# EAGLE board ra-08h_development_board_V1.0-20230228 (EAGLE 9.5.1), part 1 of 2
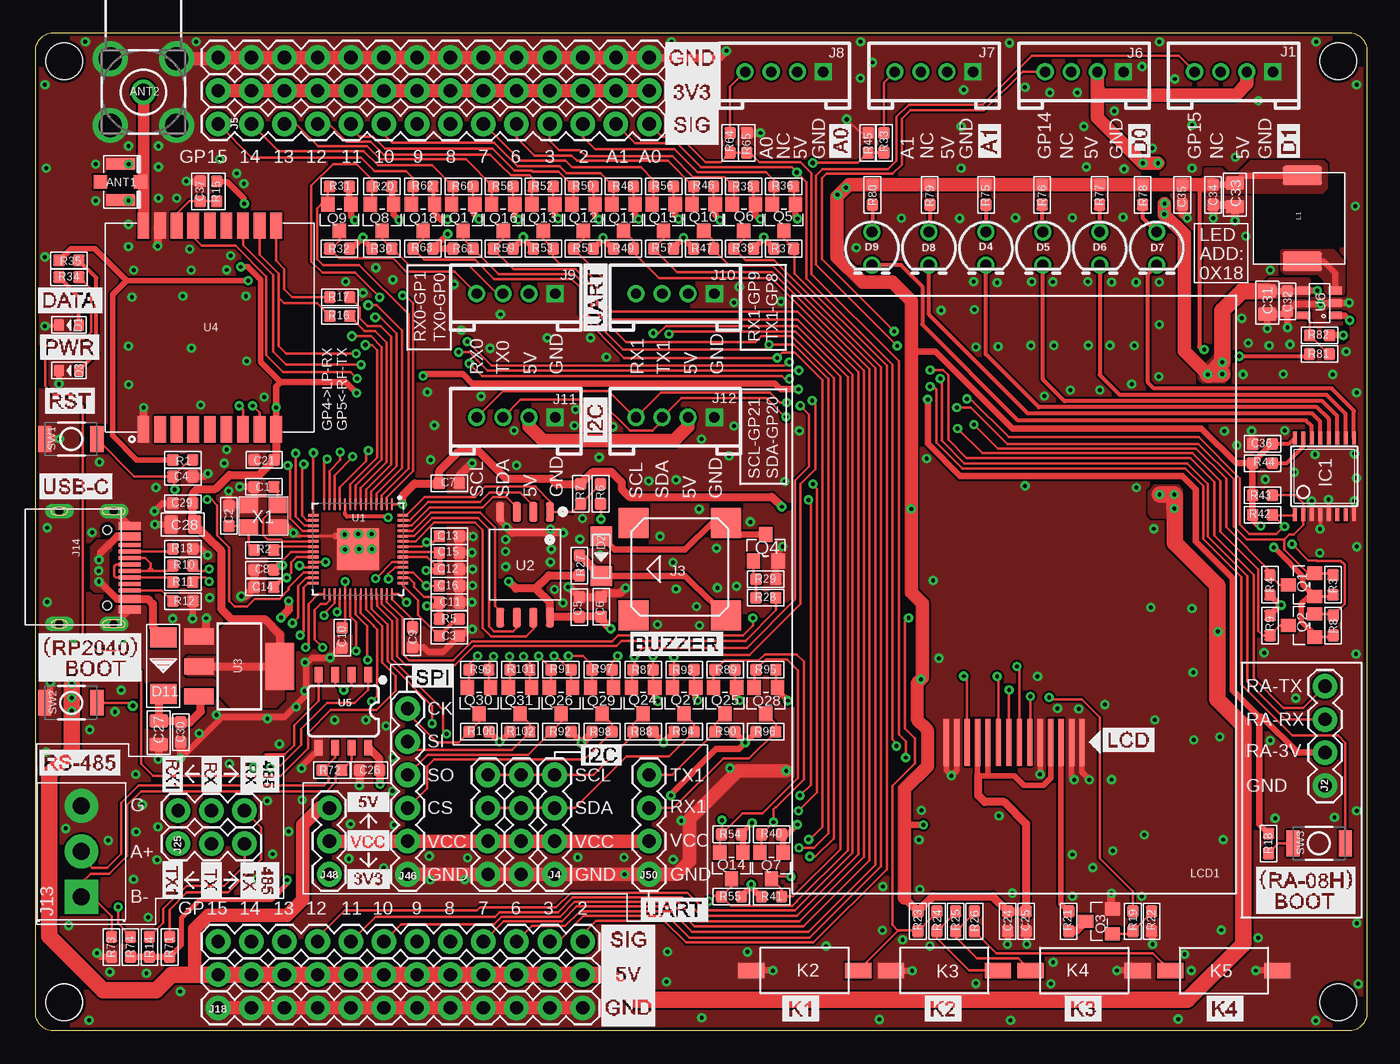
[diagram p7: board, top side]
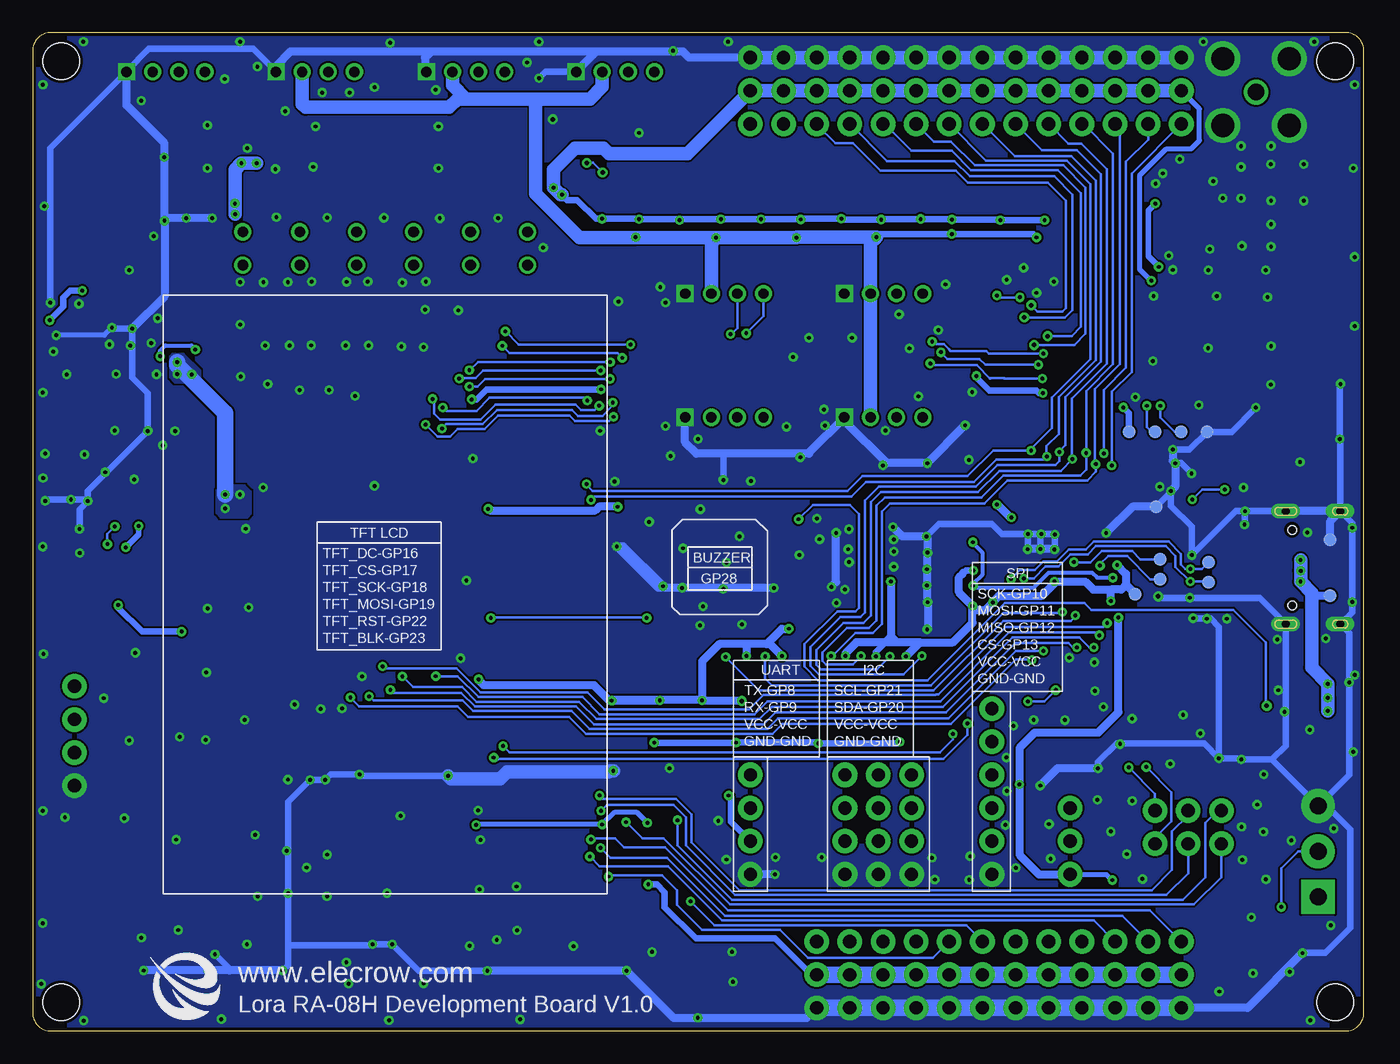
[diagram p8: board, bottom side, seen from below]

Size 102 x 76.5 mm. Coordinates in mm from the lower left corner, seen from the top.
Outline: 0,1.4 0,75.1 arc-90 1.4,76.5 100.6,76.5 arc-90 102,75.1 102,1.4 arc-90 100.6,0 1.4,0 arc-90 0,1.4
Copper layers (1*16): Top 0.035mm / dielectric 1.5mm / Bottom 0.035mm
Design rules "default *": minimum track width 0.2mm, minimum drill 0.3mm, track to track 6mil, track to pad 6mil, pad to pad 6mil, via to via 6mil, smd to smd 6mil, copper to edge 10mil, drill to drill 6mil, minimum pad ring 10mil, minimum via ring 8mil, stop-mask expansion 4mil, vias tented up to drill 100mil, thermal gap 10mil
Net classes: 0 default: width 0.203 mm; 1 PWR: width 0.254 mm; 2 GND: width 0.203 mm; 3 RS485: width 0.203 mm, clearance 0.203 mm; 4 USB: width 0.203 mm, clearance 0.152 mm; 5 ANT: width 0.889 mm, clearance 0.203 mm
Holes 2.8 mm at 2.2,74.3 99.8,74.3 2.2,2.2 99.8,2.2
tRestrict: area 98.6,52.7 to 100.6,54; 16 lines

## Footprints (pad centres in the part's own frame; a part is rotated, then mirrored left to right if it is on the bottom)
SPARKFUN2_U.FL = smd 2.2 x 0.85: P$1 0,1.375; P$2 0,-1.375 | smd 1.05 x 1: P$3 1.525,0; P$4 -1.525,0
BU-SMA-H = drill 1.27: 1 0,0 | drill 1.778: 2 -2.55,2.55; 3 2.55,2.55; 4 2.55,-2.55; 5 -2.55,-2.55
A_XBJ_0603 = smd 0.889 x 0.889: 1 -0.762,0; 2 0.762,0
A_XBJ_0805 = smd 1.016 x 1.397: 1 -0.889,0; 2 0.889,0
DISCRETE_D0603 = smd 0.762 x 0.889: + -0.762,0; - 0.762,0
DISCRETE_DO-35-SMD = smd 1.524 x 1.676: A -1.524,0; C 1.524,0
LED_3MM-NS = drill 0.813: A -1.27,0; K 1.27,0
DISCRETE_D2010 = smd 1.524 x 2.032: + -2.159,0; - 2.159,0
TSSOP16 = smd 0.305 x 0.991: 1 -2.275,-2.918; 2 -1.625,-2.918; 3 -0.975,-2.918; 4 -0.325,-2.918; 5 0.325,-2.918; 6 0.975,-2.918; 7 1.625,-2.918; 8 2.275,-2.918; 9 2.275,2.918; 10 1.625,2.918; 11 0.975,2.918; 12 0.325,2.918; 13 -0.325,2.918; 14 -0.975,2.918; 15 -1.625,2.918; 16 -2.275,2.918
CONNECTER_2.0_1X4 = drill 0.8 pad 1.27 square: 1 -3,0 | drill 0.8 pad 1.27: 2 -1,0; 3 1,0; 4 3,0
1X04 = drill 1.016 pad 1.88: 1 0,0; 2 2.54,0; 3 5.08,0; 4 7.62,0
A_XBJ_MLT-8530 = smd 2.3 x 2.3: 1 -3.55,3.55; 2 -3.55,-3.55; 3 3.55,-3.55; 4 3.55,3.55
1X14 = drill 1.016 pad 1.88: 1 0,0; 2 2.54,0; 3 5.08,0; 4 7.62,0; 5 10.16,0; 6 12.7,0; 7 15.24,0; 8 17.78,0; 9 20.32,0; 10 22.86,0; 11 25.4,0; 12 27.94,0; 13 30.48,0; 14 33.02,0
KF350_P3.5MM_3P = drill 1.3 pad 2.6 square: 1 -3.5,0 | drill 1.3 pad 2.6: 2 0,0; 3 3.5,0
KEVIN_3.0TYPEC-SMD = smd 0.3 x 1.7: A1 -3.35,0.5; A4 -2.55,0.5; A5 -1.25,0.5; A6 -0.25,0.5; A7 0.25,0.5; A8 1.25,0.5; A9 2.55,0.5; A12 3.35,0.5; B1 3.05,0.5; B4 2.25,0.5; B5 1.75,0.5; B6 0.75,0.5; B7 -0.75,0.5; B8 -1.75,0.5; B9 -2.25,0.5; B12 -3.05,0.5 | drill 0.6 pad 1.016 long: P$1 -4.325,-0.72; P$2 4.325,-0.72; P$3 -4.325,-4.9; P$4 4.325,-4.9 | hole 0.68: -2.89,-1.22; 2.89,-1.22
1X12 = drill 1.016 pad 1.88: 1 0,0; 2 2.54,0; 3 5.08,0; 4 7.62,0; 5 10.16,0; 6 12.7,0; 7 15.24,0; 8 17.78,0; 9 20.32,0; 10 22.86,0; 11 25.4,0; 12 27.94,0
1X03 = drill 1.016 pad 1.88: 1 0,0; 2 2.54,0; 3 5.08,0
1X06 = drill 1.016 pad 1.88: 1 0,0; 2 2.54,0; 3 5.08,0; 4 7.62,0; 5 10.16,0; 6 12.7,0
CROWBOT_-V1.2-20220713_CROWBOT-V1.1库_KEY_EN_2PIN_B/W = smd 2 x 1.2: 1 -4.1,0; 2 4.1,0
CROWPI_POW_L773 = smd 1.5 x 3: 1 -3.29,-0.254; 2 3.29,-0.254
TFF1.8_SPI_14P_PCB = smd 0.4 x 3.6: 1 5.2,0; 2 4.4,0; 3 3.6,0; 4 2.8,0; 5 2,0; 6 1.2,0; 7 0.4,0; 8 -0.4,0; 9 -1.2,0; 10 -2,0; 11 -2.8,0; 12 -3.6,0; 13 -4.4,0; 14 -5.2,0
CROWPI_POW_PAD-1.0MM = smd 1 x 1: P$1 0,0
DISCRETE_SOT23 = smd 1.016 x 1.143: 1 -0.889,-1.016; 2 0.889,-1.016; 3 0,1.016
DISCRETE_SOT23$1 = smd 1.016 x 1.143: 1 -0.95,-1.016; 2 0.95,-1.016; 3 0,1.016
DISCRETE_R0603 = smd 0.889 x 0.889: 1 -0.762,0; 2 0.762,0
MYSMD_157SW = smd 1.016 x 1.981: 1 0,0; 2 4,0
RP2040_QFN-56 = smd 0.875 x 0.2: 1 -3.437,2.6; 2 -3.437,2.2; 3 -3.437,1.8; 4 -3.437,1.4; 5 -3.437,1; 6 -3.437,0.6; 7 -3.437,0.2; 8 -3.437,-0.2; 9 -3.437,-0.6; 10 -3.437,-1; 11 -3.437,-1.4; 12 -3.437,-1.8; 13 -3.437,-2.2; 14 -3.437,-2.6; 29 3.437,-2.6; 30 3.437,-2.2; 31 3.437,-1.8; 32 3.437,-1.4; 33 3.437,-1; 34 3.437,-0.6; 35 3.437,-0.2; 36 3.437,0.2; 37 3.437,0.6; 38 3.437,1; 39 3.437,1.4; 40 3.437,1.8; 41 3.437,2.2; 42 3.437,2.6 | smd 0.2 x 0.875: 15 -2.6,-3.437; 16 -2.2,-3.437; 17 -1.8,-3.437; 18 -1.4,-3.437; 19 -1,-3.437; 20 -0.6,-3.437; 21 -0.2,-3.437; 22 0.2,-3.437; 23 0.6,-3.437; 24 1,-3.437; 25 1.4,-3.437; 26 1.8,-3.437; 27 2.2,-3.437; 28 2.6,-3.437; 43 2.6,3.437; 44 2.2,3.437; 45 1.8,3.437; 46 1.4,3.437; 47 1,3.437; 48 0.6,3.437; 49 0.2,3.437; 50 -0.2,3.437; 51 -0.6,3.437; 52 -1,3.437; 53 -1.4,3.437; 54 -1.8,3.437; 55 -2.2,3.437; 56 -2.6,3.437 | smd 3.2 x 3.2: EPAD 0,0
SELF_SOIC-8-208MIL = smd 1.5 x 0.635: 1 -4.05,1.905; 2 -4.05,0.635; 3 -4.05,-0.635; 4 -4.05,-1.905; 5 4.05,-1.905; 6 4.05,-0.635; 7 4.05,0.635; 8 4.05,1.905
SOT223 = smd 1.219 x 2.235: 1 -2.311,-3.099; 2 0,-3.099; 3 2.311,-3.099 | smd 3.6 x 2.2: 4 0,3.099
RA08H_MODULE_SMT_18P = smd 2 x 0.9: 1 -7.8,5.08; 2 -7.8,3.81; 3 -7.8,2.54; 4 -7.8,1.27; 5 -7.8,0; 6 -7.8,-1.27; 7 -7.8,-2.54; 8 -7.8,-3.81; 9 -7.8,-5.08; 10 7.8,-5.08; 11 7.8,-3.81; 12 7.8,-2.54; 13 7.8,-1.27; 14 7.8,0; 15 7.8,1.27; 16 7.8,2.54; 17 7.8,3.81; 18 7.8,5.08
SO08 = smd 0.6 x 1.2: 1 -1.905,-2.8; 2 -0.635,-2.8; 3 0.635,-2.8; 4 1.905,-2.8; 5 1.905,2.8; 6 0.635,2.8; 7 -0.635,2.8; 8 -1.905,2.8
CROWBOT_-V1.0-20220525_A_XBJ_SOT23-5 = smd 0.6 x 1: 1 -0.95,-1.2; 2 0,-1.2; 3 0.95,-1.2; 4 0.95,1.2; 5 -0.95,1.2
A_XBJ_SMD3225 = smd 1.4 x 1.2: 1 -1.1,-0.85; 2 1.1,-0.85; 3 1.1,0.85; 4 -1.1,0.85

## Placement (x,y rotation side)
ANT1  SPARKFUN2_U.FL  [SPARKFUN2_U.FL]  6.5,65.06 0 top
ANT2  BU-SMA-H  [BU-SMA-H]  8.26,71.94 90 top
C1  12PF  [A_XBJ_0603]  17.5,41.7 180 top
C2  12PF  [A_XBJ_0603]  14.8,39.46 270 top
C3  2.2UF  [A_XBJ_0603]  31.7,30.28 0 top
C4  100NF  [A_XBJ_0603]  11.28,42.48 0 top
C5  100NF  [A_XBJ_0603]  41.66,32.48 90 top
C6  2.2UF  [A_XBJ_0603]  43.34,32.51 90 top
C7  100NF  [A_XBJ_0603]  31.7,41.96 0 top
C8  100NF  [A_XBJ_0603]  17.5,35.35 180 top
C9  100NF  [A_XBJ_0603]  28.88,30.16 270 top
C10  100NF  [A_XBJ_0603]  23.49,30.14 270 top
C11  100NF  [A_XBJ_0603]  31.7,32.84 0 top
C12  100NF  [A_XBJ_0603]  31.7,35.37 0 top
C13  100NF  [A_XBJ_0603]  31.7,37.91 0 top
C14  100NF  [A_XBJ_0603]  17.5,34 180 top
C15  2.2UF  [A_XBJ_0603]  31.7,36.65 0 top
C16  2.2UF  [A_XBJ_0603]  31.7,34.11 0 top
C21  100NF  [A_XBJ_0603]  17.51,43.76 180 top
C24  100NF  [A_XBJ_0603]  74.48,8.4 270 top
C25  100NF  [A_XBJ_0603]  75.89,8.4 270 top
C26  100NF  [A_XBJ_0603]  25.59,19.98 0 top
C27  10UF  [A_XBJ_0805]  9.42,22.86 90 top
C28  10UF  [A_XBJ_0805]  11.28,38.81 0 top
C29  100NF  [A_XBJ_0603]  11.28,40.43 180 top
C30  100NF  [A_XBJ_0603]  11.12,22.88 270 top
C31  22UF  [A_XBJ_0805]  94.38,55.81 90 top
C32  1UF  [A_XBJ_0603]  95.91,55.92 270 top
C33  22UF  [A_XBJ_0805]  91.89,64.07 90 top
C34  1UF  [A_XBJ_0603]  90.22,64.08 270 top
C35  100NF  [A_XBJ_0603]  87.86,64.08 270 top
C36  100NF  [A_XBJ_0603]  94,45 180 top
C37  100NF  [A_XBJ_0603]  12.6,64.33 90 top
D1  [DISCRETE_D0603]  2.56,54.1 180 top
D2  1N4148  [DISCRETE_DO-35-SMD]  43.34,36.38 270 top
D3  [DISCRETE_D0603]  2.56,50.61 180 top
D4  [LED_3MM-NS]  72.81,59.95 270 top
D5  [LED_3MM-NS]  77.17,59.95 270 top
D6  [LED_3MM-NS]  81.54,59.95 270 top
D7  [LED_3MM-NS]  85.9,59.95 270 top
D8  [LED_3MM-NS]  68.44,59.95 270 top
D9  [LED_3MM-NS]  64.08,59.95 270 top
D11  SS14  [DISCRETE_D2010]  9.78,27.98 270 top
IC1  PCA9557-16P  [TSSOP16]  98.74,42.5 0 top
J1  CONNECTER_TWIG_2.0  [CONNECTER_2.0_1X4]  91.8,73.5 180 top
J2  [1X04]  98.79,18.79 90 top
J3  [A_XBJ_MLT-8530]  49.35,35.39 180 top
J4  [1X04]  39.76,12 90 top
J5  [1X14]  13.99,69.51 0 top
J6  CONNECTER_TWIG_2.0  [CONNECTER_2.0_1X4]  80.35,73.5 180 top
J7  CONNECTER_TWIG_2.0  [CONNECTER_2.0_1X4]  68.83,73.5 180 top
J8  CONNECTER_TWIG_2.0  [CONNECTER_2.0_1X4]  57.36,73.5 180 top
J9  CONNECTER_TWIG_2.0  [CONNECTER_2.0_1X4]  36.8,56.5 180 top
J10  CONNECTER_TWIG_2.0  [CONNECTER_2.0_1X4]  49,56.5 180 top
J11  CONNECTER_TWIG_2.0  [CONNECTER_2.0_1X4]  36.8,47.02 180 top
J12  CONNECTER_TWIG_2.0  [CONNECTER_2.0_1X4]  49,47.02 180 top
J13  KF350_P3.5MM_3P  [KF350_P3.5MM_3P]  3.51,13.76 90 top
J14  KEVIN_TYPEC-3.0-16P-SMD  [KEVIN_3.0TYPEC-SMD]  6.71,35.5 270 top
J18  [1X12]  13.99,1.77 0 top
J19  [1X12]  13.99,4.31 0 top
J20  [1X12]  13.99,6.85 0 top
J24  455-1750-1-ND  [1X03]  16,16.88 180 top
J25  455-1750-1-ND  [1X03]  16,14.34 180 top
J26  [1X14]  13.99,72.05 0 top
J27  [1X14]  13.99,74.59 0 top
J46  [1X06]  28.5,12 90 top
J47  [1X04]  37.2,12 90 top
J48  455-1750-1-ND  [1X03]  22.5,12 90 top
J49  [1X04]  34.66,12 90 top
J50  [1X04]  47,12 90 top
K2  CROWBO_KEY_2PIN_6.5X3.5  [CROWBOT_-V1.2-20220713_CROWBOT-V1.1库_KEY_EN_2PIN_B/W]  58.93,4.63 180 top
K3  CROWBO_KEY_2PIN_6.5X3.5  [CROWBOT_-V1.2-20220713_CROWBOT-V1.1库_KEY_EN_2PIN_B/W]  69.63,4.63 180 top
K4  CROWBO_KEY_2PIN_6.5X3.5  [CROWBOT_-V1.2-20220713_CROWBOT-V1.1库_KEY_EN_2PIN_B/W]  80.34,4.63 0 top
K5  CROWBO_KEY_2PIN_6.5X3.5  [CROWBOT_-V1.2-20220713_CROWBOT-V1.1库_KEY_EN_2PIN_B/W]  91.04,4.63 0 top
L1  2.2UH 2A  [CROWPI_POW_L773]  96.79,62.26 90 top
LCD1  TFT1.8_SPI_14P_PCB  [TFF1.8_SPI_14P_PCB]  74.97,22.12 0 top
P1  CROWPI_POW_PADPAD-1.0MM  [CROWPI_POW_PAD-1.0MM]  2.61,37.65 0 bottom
P2  CROWPI_POW_PADPAD-1.0MM  [CROWPI_POW_PAD-1.0MM]  2.61,33.35 0 bottom
P3  CROWPI_POW_PADPAD-1.0MM  [CROWPI_POW_PAD-1.0MM]  11.9,34.39 0 bottom
P4  CROWPI_POW_PADPAD-1.0MM  [CROWPI_POW_PAD-1.0MM]  11.9,35.9 0 bottom
P7  CROWPI_POW_PADPAD-1.0MM  [CROWPI_POW_PAD-1.0MM]  18,45.91 270 bottom
P8  CROWPI_POW_PADPAD-1.0MM  [CROWPI_POW_PAD-1.0MM]  16,45.91 270 bottom
P9  CROWPI_POW_PADPAD-1.0MM  [CROWPI_POW_PAD-1.0MM]  14,45.91 270 bottom
P10  CROWPI_POW_PADPAD-1.0MM  [CROWPI_POW_PAD-1.0MM]  12,45.91 270 bottom
P11  CROWPI_POW_PADPAD-1.0MM  [CROWPI_POW_PAD-1.0MM]  15.6,36.13 0 bottom
P12  CROWPI_POW_PADPAD-1.0MM  [CROWPI_POW_PAD-1.0MM]  15.63,34.61 0 bottom
P13  CROWPI_POW_PADPAD-1.0MM  [CROWPI_POW_PAD-1.0MM]  17.53,33.48 0 bottom
P14  CROWPI_POW_PADPAD-1.0MM  [CROWPI_POW_PAD-1.0MM]  15.91,40.18 0 bottom
Q1  2N7002  [DISCRETE_SOT23]  97,34.18 90 top
Q2  2N7002  [DISCRETE_SOT23]  97,31.07 90 top
Q3  S9013  [DISCRETE_SOT23$1]  81.48,8.4 90 top
Q4  S9013  [DISCRETE_SOT23$1]  55.95,37.02 0 top
Q5  2N7002  [DISCRETE_SOT23]  57.33,62.33 180 top
Q6  2N7002  [DISCRETE_SOT23]  54.26,62.33 180 top
Q7  2N7002  [DISCRETE_SOT23]  56.38,12.68 180 top
Q8  2N7002  [DISCRETE_SOT23]  26.54,62.33 180 top
Q9  2N7002  [DISCRETE_SOT23]  23.27,62.33 180 top
Q10  2N7002  [DISCRETE_SOT23]  51.19,62.33 180 top
Q11  2N7002  [DISCRETE_SOT23]  45.04,62.33 180 top
Q12  2N7002  [DISCRETE_SOT23]  41.97,62.33 180 top
Q13  2N7002  [DISCRETE_SOT23]  38.9,62.33 180 top
Q14  2N7002  [DISCRETE_SOT23]  53.31,12.68 180 top
Q15  2N7002  [DISCRETE_SOT23]  48.11,62.33 180 top
Q16  2N7002  [DISCRETE_SOT23]  35.83,62.33 180 top
Q17  2N7002  [DISCRETE_SOT23]  32.75,62.33 180 top
Q18  2N7002  [DISCRETE_SOT23]  29.68,62.33 180 top
Q24  2N7002  [DISCRETE_SOT23]  46.54,25.3 180 top
Q25  2N7002  [DISCRETE_SOT23]  52.82,25.3 180 top
Q26  2N7002  [DISCRETE_SOT23]  40.26,25.3 180 top
Q27  2N7002  [DISCRETE_SOT23]  49.68,25.3 180 top
Q28  2N7002  [DISCRETE_SOT23]  55.95,25.3 180 top
Q29  2N7002  [DISCRETE_SOT23]  43.4,25.3 180 top
Q30  2N7002  [DISCRETE_SOT23]  33.97,25.3 180 top
Q31  2N7002  [DISCRETE_SOT23]  37.11,25.3 180 top
R1  10K  [DISCRETE_R0603]  11.28,43.76 180 top
R2  1K  [DISCRETE_R0603]  17.5,36.84 0 top
R3  4.7K  [DISCRETE_R0603]  99.4,34.18 270 top
R4  4.7K  [DISCRETE_R0603]  94.57,34.18 270 top
R5  0R  [DISCRETE_R0603]  31.7,31.56 180 top
R6  1K  [DISCRETE_R0603]  43.28,41.16 270 top
R7  10K  [DISCRETE_R0603]  41.76,41.15 90 top
R8  4.7K  [DISCRETE_R0603]  99.42,31.07 270 top
R9  4.7K  [DISCRETE_R0603]  94.58,31.07 90 top
R10  22R  [DISCRETE_R0603]  11.28,35.66 0 top
R11  22R  [DISCRETE_R0603]  11.28,34.38 0 top
R12  5.1K  [DISCRETE_R0603]  11.29,32.94 0 top
R13  5.1K  [DISCRETE_R0603]  11.28,36.96 180 top
R14  4.7K  [DISCRETE_R0603]  8.71,6.45 270 top
R15  10K  [DISCRETE_R0603]  13.88,64.33 270 top
R16  0R  [DISCRETE_R0603]  23.31,54.79 0 top
R17  0R  [DISCRETE_R0603]  23.3,56.23 0 top
R18  0R  [DISCRETE_R0603]  94.46,14.37 90 top
R19  1K  [DISCRETE_R0603]  84.07,8.4 270 top
R20  4.7K  [DISCRETE_R0603]  26.54,64.7 0 top
R21  22R  [DISCRETE_R0603]  79.16,8.4 90 top
R22  10K  [DISCRETE_R0603]  85.5,8.4 270 top
R23  1K  [DISCRETE_R0603]  67.6,8.4 90 top
R24  1K  [DISCRETE_R0603]  69.06,8.4 90 top
R25  1K  [DISCRETE_R0603]  70.5,8.4 90 top
R26  1K  [DISCRETE_R0603]  71.93,8.4 90 top
R27  100R  [DISCRETE_R0603]  41.67,35.66 270 top
R28  1K  [DISCRETE_R0603]  55.95,33.2 0 top
R29  10K  [DISCRETE_R0603]  55.95,34.62 180 top
R30  4.7K  [DISCRETE_R0603]  26.54,59.95 180 top
R31  4.7K  [DISCRETE_R0603]  23.27,64.7 0 top
R32  4.7K  [DISCRETE_R0603]  23.27,59.95 0 top
R33  240R 1%  [DISCRETE_R0603]  65,68.06 90 top
R34  3K  [DISCRETE_R0603]  2.56,57.76 0 top
R35  4.7K  [DISCRETE_R0603]  2.56,59.04 180 top
R36  4.7K  [DISCRETE_R0603]  57.33,64.71 0 top
R37  4.7K  [DISCRETE_R0603]  57.33,59.95 180 top
R38  4.7K  [DISCRETE_R0603]  54.26,64.71 0 top
R39  4.7K  [DISCRETE_R0603]  54.26,59.95 0 top
R40  4.7K  [DISCRETE_R0603]  56.38,15.07 0 top
R41  4.7K  [DISCRETE_R0603]  56.38,10.31 180 top
R42  4.7K  [DISCRETE_R0603]  94,39.56 180 top
R43  4.7K  [DISCRETE_R0603]  94,41.05 180 top
R44  4.7K  [DISCRETE_R0603]  94,43.51 180 top
R45  470R 1%  [DISCRETE_R0603]  63.79,68.06 270 top
R46  4.7K  [DISCRETE_R0603]  51.19,64.71 0 top
R47  4.7K  [DISCRETE_R0603]  51.19,59.95 180 top
R48  4.7K  [DISCRETE_R0603]  45.04,64.71 0 top
R49  4.7K  [DISCRETE_R0603]  45.04,59.95 180 top
R50  4.7K  [DISCRETE_R0603]  41.97,64.71 0 top
R51  4.7K  [DISCRETE_R0603]  41.97,59.95 0 top
R52  4.7K  [DISCRETE_R0603]  38.9,64.71 0 top
R53  4.7K  [DISCRETE_R0603]  38.9,59.95 180 top
R54  4.7K  [DISCRETE_R0603]  53.31,15.07 0 top
R55  4.7K  [DISCRETE_R0603]  53.31,10.31 0 top
R56  4.7K  [DISCRETE_R0603]  48.11,64.71 0 top
R57  4.7K  [DISCRETE_R0603]  48.11,59.95 0 top
R58  4.7K  [DISCRETE_R0603]  35.83,64.71 0 top
R59  4.7K  [DISCRETE_R0603]  35.83,59.95 0 top
R60  4.7K  [DISCRETE_R0603]  32.75,64.71 0 top
R61  4.7K  [DISCRETE_R0603]  32.75,59.95 180 top
R62  4.7K  [DISCRETE_R0603]  29.68,64.71 0 top
R63  4.7K  [DISCRETE_R0603]  29.68,59.95 0 top
R64  240R 1%  [DISCRETE_R0603]  53.21,68.06 90 top
R65  470R 1%  [DISCRETE_R0603]  54.49,68.06 270 top
R71  4.7K  [DISCRETE_R0603]  10.27,6.45 270 top
R72  120R  [DISCRETE_R0603]  22.71,19.98 0 top
R73  4.7K  [DISCRETE_R0603]  5.82,6.45 270 top
R74  4.7K  [DISCRETE_R0603]  7.26,6.45 90 top
R75  1K  [DISCRETE_R0603]  72.81,64.08 90 top
R76  1K  [DISCRETE_R0603]  77.11,64.08 90 top
R77  1K  [DISCRETE_R0603]  81.52,64.08 90 top
R78  1K  [DISCRETE_R0603]  84.81,64.08 90 top
R79  1K  [DISCRETE_R0603]  68.52,64.08 90 top
R80  1K  [DISCRETE_R0603]  64.11,64.08 90 top
R81  45.3K 1%  [DISCRETE_R0603]  98.36,51.87 0 top
R82  10K 1%  [DISCRETE_R0603]  98.37,53.31 180 top
R87  4.7K  [DISCRETE_R0603]  46.54,27.68 0 top
R88  4.7K  [DISCRETE_R0603]  46.54,22.93 0 top
R89  4.7K  [DISCRETE_R0603]  52.82,27.68 0 top
R90  4.7K  [DISCRETE_R0603]  52.82,22.93 0 top
R91  4.7K  [DISCRETE_R0603]  40.26,27.68 0 top
R92  4.7K  [DISCRETE_R0603]  40.26,22.93 0 top
R93  4.7K  [DISCRETE_R0603]  49.68,27.68 0 top
R94  4.7K  [DISCRETE_R0603]  49.68,22.93 180 top
R95  4.7K  [DISCRETE_R0603]  55.95,27.68 0 top
R96  4.7K  [DISCRETE_R0603]  55.95,22.93 180 top
R97  4.7K  [DISCRETE_R0603]  43.4,27.68 0 top
R98  4.7K  [DISCRETE_R0603]  43.4,22.93 180 top
R99  4.7K  [DISCRETE_R0603]  33.97,27.68 0 top
R100  4.7K  [DISCRETE_R0603]  33.97,22.93 0 top
R101  4.7K  [DISCRETE_R0603]  37.11,27.68 0 top
R102  4.7K  [DISCRETE_R0603]  37.11,22.93 180 top
SW1  [MYSMD_157SW]  0.7,45.35 0 top
SW2  [MYSMD_157SW]  0.7,25.15 0 top
SW3  [MYSMD_157SW]  100.35,14.37 180 top
U1  RP2040_RP2040  [RP2040_QFN-56]  24.71,36.92 270 top
U2  SELF_W25Q128JV  [SELF_SOIC-8-208MIL]  37.5,35.73 270 top
U3  LD1117-3V3-SOT223  [SOT223]  15.61,27.93 270 top
U4  RA08H_MODULE_SMD_18P  [RA08H_MODULE_SMT_18P]  13.35,53.9 90 top
U5  MAX3485CSA  [SO08]  23.58,24.51 180 top
U6  HM3416H  [CROWBOT_-V1.0-20220525_A_XBJ_SOT23-5]  98.37,55.78 90 top
U$26  [ELECROW-NEW]  93.05,0.84 0 bottom
X1  12MHZ_SMD3225  [A_XBJ_SMD3225]  17.44,39.45 180 top